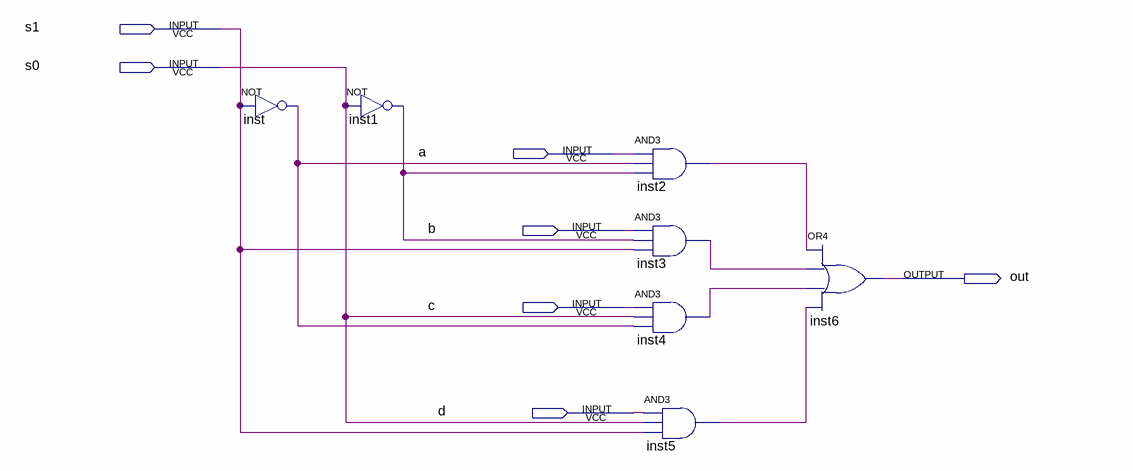
[diagram p0: schematic sheet]
// Quartus schematic four_to_one_mux.bdf as structural Verilog: 7 symbols, 7 pins
module four_to_one_mux (
  input  s1,
  input  s0,
  input  a,
  input  b,
  input  c,
  input  d,
  output out
);

  wire inst1_out, inst2_out, inst3_out, inst4_out, inst5_out, inst_out;

  not inst (inst_out, s1);
  not inst1 (inst1_out, s0);
  and inst2 (inst2_out, a, inst_out, inst1_out);
  and inst3 (inst3_out, b, inst1_out, s1);
  and inst4 (inst4_out, c, s0, inst_out);
  and inst5 (inst5_out, d, s0, s1);
  or inst6 (out, inst2_out, inst3_out, inst4_out, inst5_out);
endmodule
